# EAGLE design led-er-breakout-single-RJ45 (EAGLE 7.2.0)
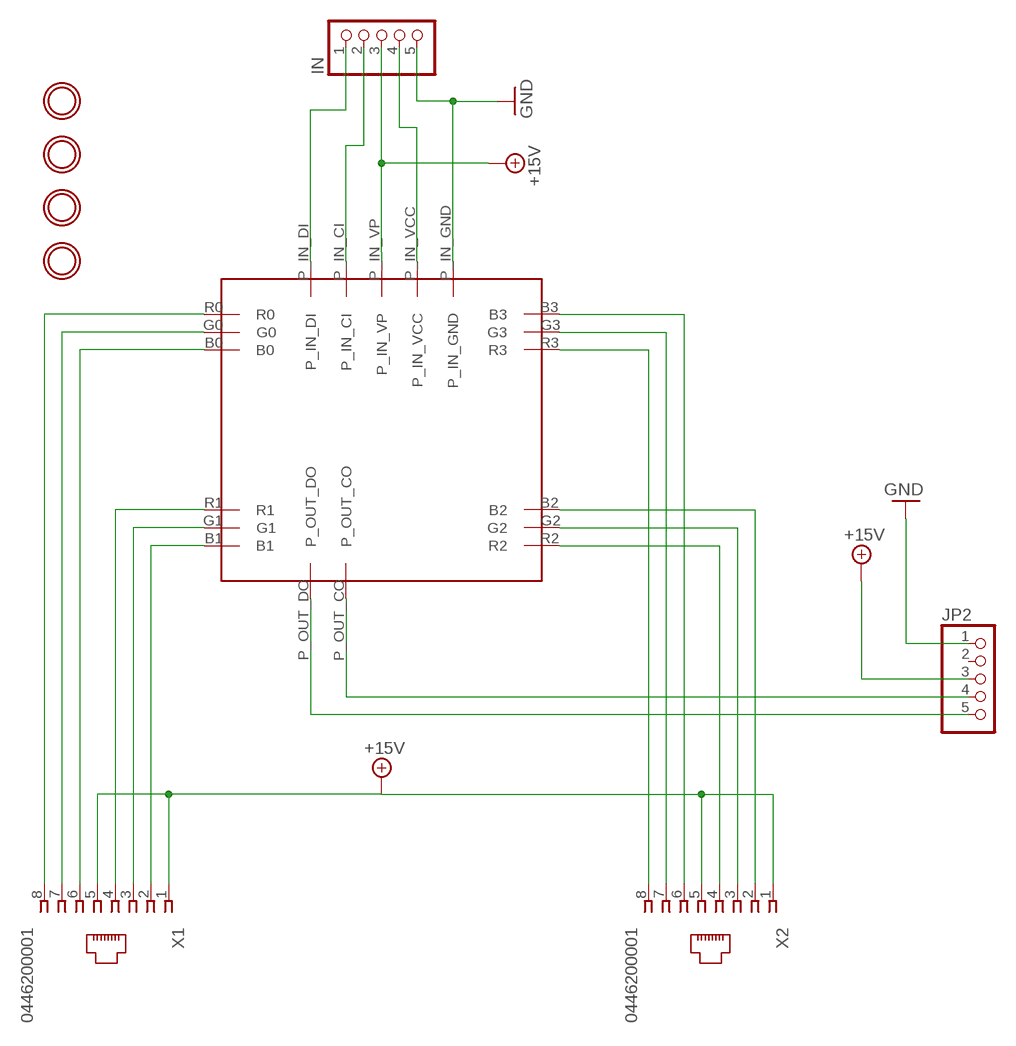
[diagram p0: schematic, sheet 1]

## Parts
IN  HEADER-1X5  [1X05_OVAL]
JP2  HEADER-1X5  [1X05_OVAL]
U$1  MOUNTINGHOLE2.0  [MOUNTINGHOLE_2.0_PLATED]
U$2  MOUNTINGHOLE2.0  [MOUNTINGHOLE_2.0_PLATED]
U$3  MOUNTINGHOLE2.0  [MOUNTINGHOLE_2.0_PLATED]
U$4  MOUNTINGHOLE2.0  [MOUNTINGHOLE_2.0_PLATED]
U$6  TLC59711_BREAKOUT  [TLC59711_BREAKOUT]
X1  0446200001  [0446200001]
X2  0446200001  [0446200001]

## Nets
+15V: IN.3 JP2.3 U$6.P_IN_VP X1.1 X1.5 X2.1 X2.5
GND: IN.5 JP2.1 U$6.P_IN_GND
N$1: U$6.R0 X1.8
N$2: U$6.G0 X1.7
N$3: U$6.B0 X1.6
N$4: U$6.R1 X1.4
N$5: U$6.G1 X1.3
N$6: U$6.B1 X1.2
N$9: U$6.R3 X2.8
N$10: U$6.G3 X2.7
N$11: U$6.B3 X2.6
N$12: U$6.R2 X2.4
N$13: U$6.G2 X2.3
N$14: U$6.B2 X2.2
N$15: IN.4 U$6.P_IN_VCC
N$16: IN.2 U$6.P_IN_CI
N$17: IN.1 U$6.P_IN_DI
N$19: JP2.4 U$6.P_OUT_CO
N$20: JP2.5 U$6.P_OUT_DO
Unconnected: JP2.2

## Library data of the parts
IN JP2 = microbuilder:HEADER-1X5: PIN HEADER
U$1-U$4 = microbuilder:MOUNTINGHOLE: Mounting Hole For #2 screws (0.086"/2.18mm width, 0.094"/2.4mm hole) use 2.5mm
U$6 = Andrews:TLC59711_BREAKOUT: Adafruit TLC59711 breakout board footprint
X1 X2 = con-molex:0446200001: RJ-45 INVERTED MODULAR JACK ASSEMBLY WITH RJ-11 KEEPOUT FEATURE Source: Data sheet <http://www.farnell.com/datasheets/73207.pdf>; OC_FARNELL: unknown

## Board
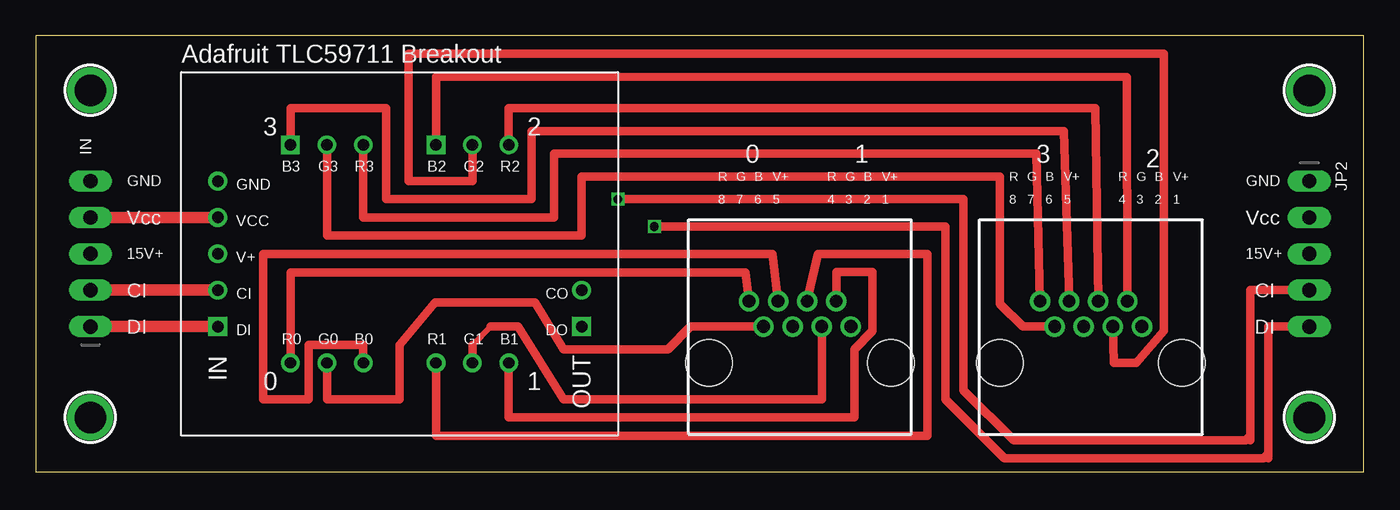
[diagram p1: board, top side]
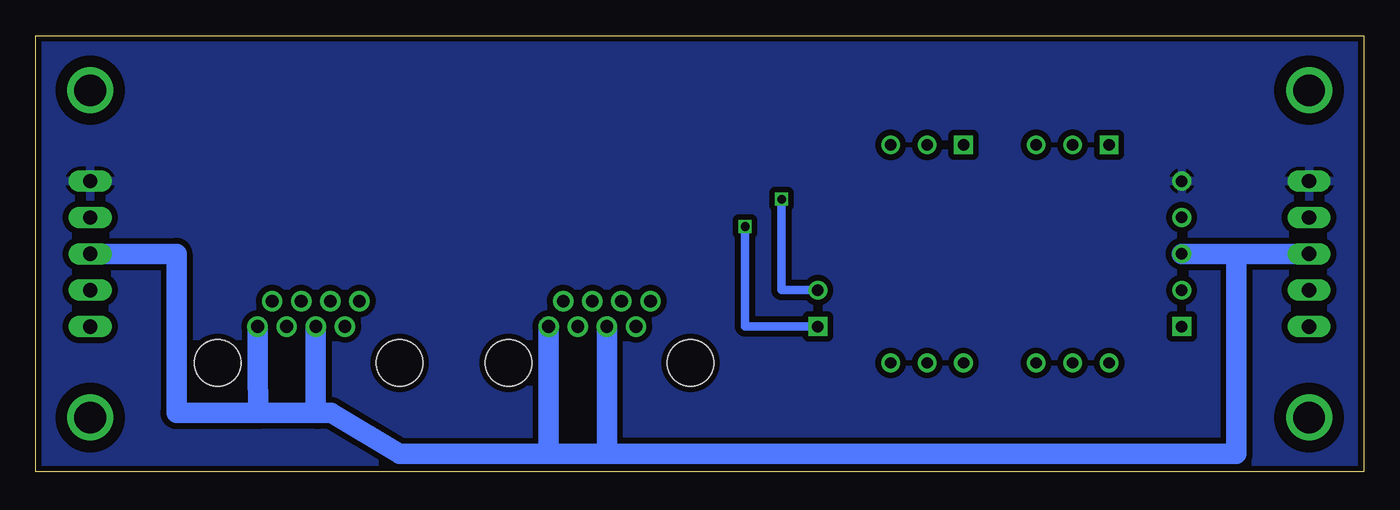
[diagram p2: board, bottom side, seen from below]

Size 92.7 x 30.47 mm. Coordinates in mm from the lower left corner, seen from the top.
Outline: 0,0 92.7,0 92.7,30.47 0,30.47 0,0
Copper layers (1*16): Top 0.035mm / dielectric 1.5mm / Bottom 0.035mm
Design rules "batchpcb *": minimum track width 6mil, minimum drill 12mil, track to track 6mil, track to pad 6mil, pad to pad 6mil, via to via 6mil, smd to smd 0mil, copper to edge 10mil, drill to drill 10mil, minimum pad ring 10mil, minimum via ring 6mil, stop-mask expansion 2mil, vias tented up to drill 100mil, thermal gap 10mil

### Footprints (pad centres in the part's own frame; a part is rotated, then mirrored left to right if it is on the bottom)
1X05_OVAL = drill 1 long: 1 -5.08,0; 2 -2.54,0; 3 0,0; 4 2.54,0; 5 5.08,0
MOUNTINGHOLE_2.0_PLATED = drill 2.2 pad 3: P$1 0,0
TLC59711_BREAKOUT = drill 0.8: B0 -2.54,-7.62; B1 7.62,-7.62; G0 -5.08,-7.62; G1 5.08,-7.62; G2 5.08,7.62; G3 -5.08,7.62; P_IN_CI -12.7,-2.54; P_IN_GND -12.7,5.08; P_IN_VCC -12.7,2.54; P_IN_VP -12.7,0; P_OUT_CO 12.7,-2.54; R0 -7.62,-7.62; R1 2.54,-7.62; R2 7.62,7.62; R3 -2.54,7.62 | drill 0.8 square: B2 2.54,7.62; B3 -7.62,7.62; P_IN_DI -12.7,-5.08; P_OUT_DO 12.7,-5.08
0446200001 = drill 0.889 pad 1.422: 1 3.556,2.54; 2 2.54,4.318; 3 1.524,2.54; 4 0.508,4.318; 5 -0.508,2.54; 6 -1.524,4.318; 7 -2.54,2.54; 8 -3.556,4.318 | hole 3.251: 6.35,0; -6.35,0

### Placement (x,y rotation side)
IN  3.81,15.24 90 top
JP2  88.9,15.24 270 top
U$1  3.81,26.67 0 top
U$2  3.81,3.81 0 top
U$3  88.9,3.81 0 top
U$4  88.9,26.67 0 top
U$6  25.4,15.24 0 top
X1  53.34,7.62 0 top
X2  73.66,7.62 0 top

### Tracks (layer width: path | path; a pad name or v marks a point on that pad's centre or on a via)
+15V
  Bottom 1.422: IN.3 U$6.P_IN_VP 8.89,15.24 8.89,1.27 52.83,1.27 | 52.83,1.27 X1.5 | JP2.3 82.87,15.24 82.87,4.13 77.15,4.13 | 57.15,1.27 67.31,1.27 72.07,4.13 73.03,4.13 | 57.15,1.27 52.83,1.27 | X1.1 56.9,1.52 57.15,1.27 | X2.5 73.15,4.25 73.03,4.13 | X2.1 77.22,6.29 77.15,4.13 | 73.03,4.13 77.15,4.13
GND
  pour Bottom (isolate 0.406): 0,30.48 0,0 92.71,0 92.71,30.48
N$1
  Top 0.61: U$6.R0 17.78,13.95 49.53,13.95 X1.8
N$2
  Top 0.61: U$6.G0 20.32,5.08 25.4,5.08 25.4,8.89 27.86,11.85 34.85,11.85 36.83,8.57 44.13,8.57 45.72,10.16 X1.7
N$3
  Top 0.61: U$6.B0 22.86,8.89 19.05,8.89 19.05,5.08 15.88,5.08 15.88,15.24 51.44,15.24 X1.6
N$4
  Top 0.61: U$6.R1 27.94,2.54 62.23,2.54 62.23,15.24 54.61,15.24 X1.4
N$5
  Top 0.406: 30.48,8.89 31.75,10.16
  Top 0.61: U$6.G1 30.48,8.89 | 31.75,10.16 33.66,10.16 36.83,5.08 54.86,5.08 X1.3
N$6
  Top 0.61: U$6.B1 33.02,3.81 57.15,3.81 57.15,8.57 58.42,9.84 58.42,13.97 55.88,13.97 X1.2
N$9
  Top 0.61: X2.8 69.85,22.23 36.2,22.23 36.2,17.78 22.86,17.78 U$6.R3
N$10
  Top 0.61: U$6.G3 20.32,16.51 38.1,16.51 38.1,20.64 67.31,20.64 67.31,11.75 68.9,10.16 X2.7
N$11
  Top 0.61: X2.6 71.75,23.81 34.61,23.81 34.61,19.05 24.45,19.05 24.45,25.4 17.78,25.4 U$6.B3
N$12
  Top 0.61: U$6.R2 33.02,25.4 73.98,25.4 X2.4
N$13
  Top 0.61: X2.3 75.25,7.62 76.83,7.62 78.74,9.84 78.74,29.21 26.04,29.21 26.04,20.32 30.48,20.32 U$6.G2
N$14
  Top 0.61: X2.2 76.16,27.59 27.94,27.62 U$6.B2
N$15
  Top 0.813: IN.4 U$6.P_IN_VCC
N$16
  Top 0.813: IN.2 U$6.P_IN_CI
N$17
  Top 0.813: IN.1 U$6.P_IN_DI
N$19  (via drill 0.6)
  Top 0.61: v40.64,19.05 64.77,19.05 64.77,5.71 68.26,2.22 84.45,2.22 84.77,2.54 | 84.77,2.22 84.77,2.54 | 84.77,2.54 84.77,12.7 JP2.4
  Bottom 0.61: U$6.P_OUT_CO 40.64,12.7 v40.64,19.05
N$20  (via drill 0.6)
  Top 0.61: v43.18,17.14 63.5,17.14 63.5,5.08 67.63,0.95 85.72,0.95 86.04,1.27 | 86.04,0.95 86.04,1.27 | 86.04,1.27 86.04,10.16 JP2.5
  Bottom 0.61: U$6.P_OUT_DO 43.18,10.16 v43.18,17.14

### Text on the board
tPlace: 0 | 1 | 3 | 2 | GND | R | G | B | V+ | R | G | B | V+ | R | G | B | V+ | R | G | B | V+ | GND | 8 | 7 | 6 | 5 | 4 | 3 | 2 | 1 | 8 | 7 | 6 | 5 | 4 | 3 | 2 | 1 | Vcc | Vcc | 15V+ | 15V+ | CI | CI | DI | DI